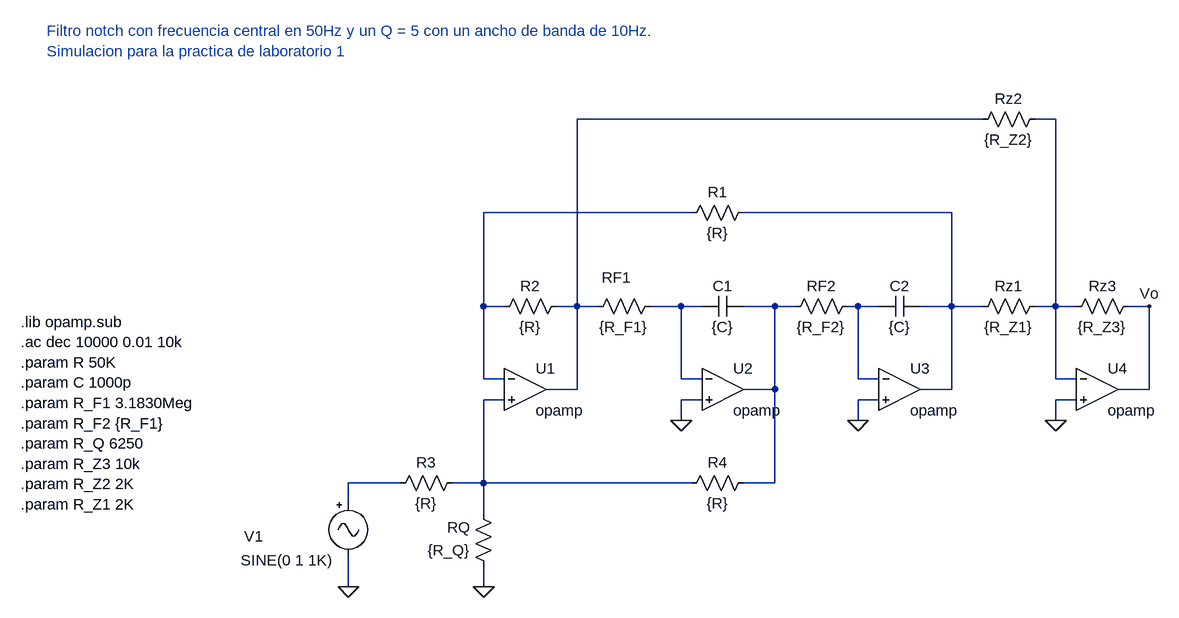
[diagram p0: schematic notch_tpl1_50hz.asc]
notch_tpl1_50hz.asc, the LTspice schematic file:
Version 4
SHEET 1 1560 744
WIRE 960 -48 336 -48
WIRE 1072 -48 1040 -48
WIRE 512 96 192 96
WIRE 912 96 592 96
WIRE 192 240 192 96
WIRE 224 240 192 240
WIRE 336 240 336 -48
WIRE 336 240 304 240
WIRE 368 240 336 240
WIRE 496 240 448 240
WIRE 528 240 496 240
WIRE 640 240 592 240
WIRE 672 240 640 240
WIRE 768 240 752 240
WIRE 800 240 768 240
WIRE 912 240 912 96
WIRE 912 240 864 240
WIRE 960 240 912 240
WIRE 1072 240 1072 -48
WIRE 1072 240 1040 240
WIRE 1104 240 1072 240
WIRE 1216 240 1184 240
WIRE 192 352 192 240
WIRE 224 352 192 352
WIRE 496 352 496 240
WIRE 528 352 496 352
WIRE 768 352 768 240
WIRE 800 352 768 352
WIRE 1072 352 1072 240
WIRE 1104 352 1072 352
WIRE 336 368 336 240
WIRE 336 368 288 368
WIRE 640 368 640 240
WIRE 640 368 592 368
WIRE 912 368 912 240
WIRE 912 368 864 368
WIRE 1216 368 1216 240
WIRE 1216 368 1168 368
WIRE 224 384 192 384
WIRE 528 384 496 384
WIRE 800 384 768 384
WIRE 1104 384 1072 384
WIRE 496 416 496 384
WIRE 768 416 768 384
WIRE 1072 416 1072 384
WIRE 64 512 -16 512
WIRE 192 512 192 384
WIRE 192 512 144 512
WIRE 512 512 192 512
WIRE 640 512 640 368
WIRE 640 512 592 512
WIRE -16 544 -16 512
WIRE 192 560 192 512
WIRE -16 672 -16 624
WIRE 192 672 192 640
FLAG 1072 416 0
FLAG 768 416 0
FLAG 496 416 0
FLAG 192 672 0
FLAG -16 672 0
FLAG 1216 240 Vo
SYMBOL Opamps/opamp 256 304 R0
SYMATTR InstName U1
SYMBOL Opamps/opamp 560 304 R0
SYMATTR InstName U2
SYMBOL Opamps/opamp 832 304 R0
SYMATTR InstName U3
SYMBOL Opamps/opamp 1136 304 R0
SYMATTR InstName U4
SYMBOL res 320 224 R90
WINDOW 0 0 56 VBottom 2
WINDOW 3 32 56 VTop 2
SYMATTR InstName R2
SYMATTR Value {R}
SYMBOL res 608 80 R90
WINDOW 0 0 56 VBottom 2
WINDOW 3 32 56 VTop 2
SYMATTR InstName R1
SYMATTR Value {R}
SYMBOL res 464 224 R90
WINDOW 0 -13 67 VBottom 2
WINDOW 3 32 56 VTop 2
SYMATTR InstName RF1
SYMATTR Value {R_F1}
SYMBOL res 768 224 R90
WINDOW 0 0 56 VBottom 2
WINDOW 3 32 56 VTop 2
SYMATTR InstName RF2
SYMATTR Value {R_F2}
SYMBOL res 1056 224 R90
WINDOW 0 0 56 VBottom 2
WINDOW 3 32 56 VTop 2
SYMATTR InstName Rz1
SYMATTR Value {R_Z1}
SYMBOL res 1056 -64 R90
WINDOW 0 0 56 VBottom 2
WINDOW 3 32 56 VTop 2
SYMATTR InstName Rz2
SYMATTR Value {R_Z2}
SYMBOL res 1200 224 R90
WINDOW 0 0 56 VBottom 2
WINDOW 3 32 56 VTop 2
SYMATTR InstName Rz3
SYMATTR Value {R_Z3}
SYMBOL res 608 496 R90
WINDOW 0 0 56 VBottom 2
WINDOW 3 32 56 VTop 2
SYMATTR InstName R4
SYMATTR Value {R}
SYMBOL res 160 496 R90
WINDOW 0 0 56 VBottom 2
WINDOW 3 32 56 VTop 2
SYMATTR InstName R3
SYMATTR Value {R}
SYMBOL res 208 656 R180
WINDOW 0 36 76 Left 2
WINDOW 3 36 40 Left 2
SYMATTR InstName RQ
SYMATTR Value {R_Q}
SYMBOL cap 592 224 R90
WINDOW 0 0 32 VBottom 2
WINDOW 3 32 32 VTop 2
SYMATTR InstName C1
SYMATTR Value {C}
SYMBOL cap 864 224 R90
WINDOW 0 0 32 VBottom 2
WINDOW 3 32 32 VTop 2
SYMATTR InstName C2
SYMATTR Value {C}
SYMBOL Misc/signal -16 528 R0
WINDOW 0 -160 66 Left 2
WINDOW 3 -166 103 Left 2
SYMATTR InstName V1
SYMATTR Value2 AC 1
TEXT -520 264 Left 2 !.lib opamp.sub\n.ac dec 10000 0.01 10k\n.param R 50K\n.param C 1000p\n.param R_F1 3.1830Meg\n.param R_F2 {R_F1}\n.param R_Q 6250\n.param R_Z3 10k\n.param R_Z2 2K\n.param R_Z1 2K
TEXT -480 -184 Left 2 ;Filtro notch con frecuencia central en 50Hz y un Q = 5 con un ancho de banda de 10Hz.\nSimulacion para la practica de laboratorio 1

The netlist it stands for:
* notch_tpl1_50hz.asc
XU1 N003 N008 N001 opamp Aol=100K GBW=10Meg  ; pins invin noninvin out
XU2 N005 0 N006 opamp Aol=100K GBW=10Meg  ; pins invin noninvin out
XU3 N007 0 N004 opamp Aol=100K GBW=10Meg  ; pins invin noninvin out
XU4 N002 0 Vo opamp Aol=100K GBW=10Meg  ; pins invin noninvin out
R2 N001 N003 {R}
R1 N004 N003 {R}
RF1 N005 N001 {R_F1}
RF2 N007 N006 {R_F2}
Rz1 N002 N004 {R_Z1}
Rz2 N002 N001 {R_Z2}
Rz3 Vo N002 {R_Z3}
R4 N006 N008 {R}
R3 N008 N009 {R}
RQ 0 N008 {R_Q}
C1 N006 N005 {C}
C2 N004 N007 {C}
V1 N009 0 SINE(0 1 1K) AC 1
.lib opamp.sub
.ac dec 10000 0.01 10k
.param R 50K
.param C 1000p
.param R_F1 3.1830Meg
.param R_F2 {R_F1}
.param R_Q 6250
.param R_Z3 10k
.param R_Z2 2K
.param R_Z1 2K
* Filtro notch con frecuencia central en 50Hz y un Q = 5 con un ancho de banda de 10Hz.
* Simulacion para la practica de laboratorio 1
.backanno
.end